# Altium project ASSD_Muestreo.PrjPCB
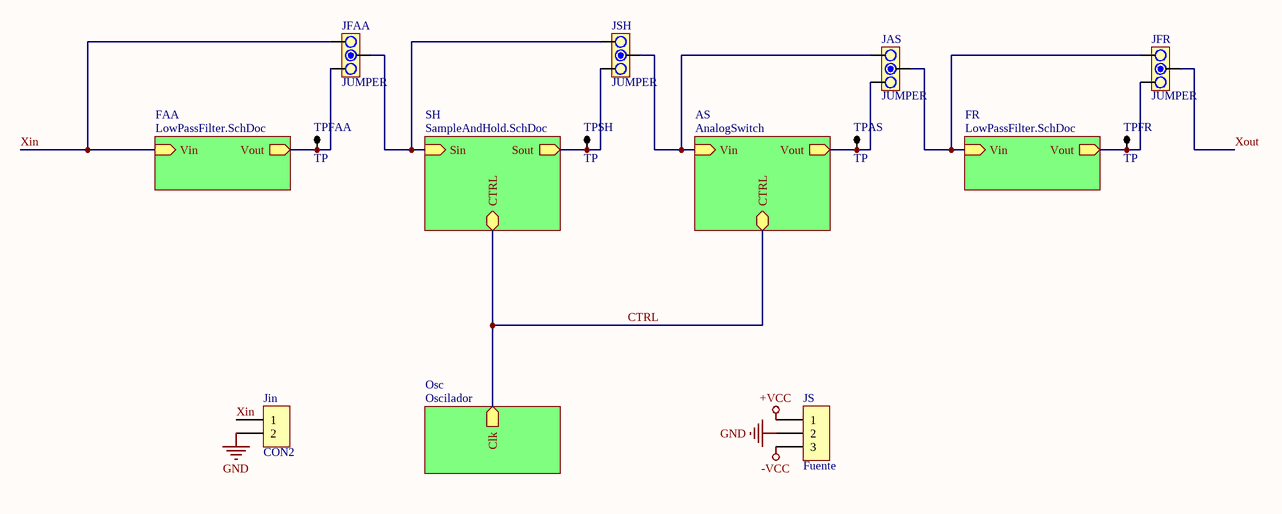
[diagram p0: TP1SCH.SchDoc]
5 sheets, 75 parts. Net scope: hierarchical (ports join the sheet entries above them; power ports are global).
Board file: TP1PCB.PcbDoc
Sheets:
  TP1SCH.SchDoc
    FAA = LowPassFilter.SchDoc
    SH = SampleAndHold.SchDoc
    AS = AnalogSwitch.SchDoc
    FR = LowPassFilter.SchDoc
    Osc = Oscilador.SchDoc

## Sheet TP1SCH.SchDoc
size A4

### Parts
JAS  JUMPER  [JUMPER3]
JFAA  JUMPER  [JUMPER3]
JFR  JUMPER  [JUMPER3]
Jin  CON2  [SIP2]
JS  Fuente  [SIP3]
JSH  JUMPER  [JUMPER3]
TPAS  TP  [TPTH]
TPFAA  TP  [TPTH]
TPFR  TP  [TPTH]
TPSH  TP  [TPTH]

### Sub-sheets
AS = AnalogSwitch: Vin (in), CTRL (bidir), Vout (out)
FAA = LowPassFilter.SchDoc: Vin (in), Vout (out)
FR = LowPassFilter.SchDoc: Vin (in), Vout (out)
Osc = Oscilador: Clk (out)
SH = SampleAndHold.SchDoc: Sin (in), Sout (out), CTRL (bidir)

### Nets
+VCC: JS.1
-VCC: JS.3
GND: Jin.2 JS.2
CTRL: sheet SH/CTRL, sheet AS/CTRL, sheet Osc/Clk
V4out: JFAA.1 TPFAA.1 ; sheet FAA/Vout
V4out: JFR.1 TPFR.1 ; sheet FR/Vout  [a separate net that carries the same name]
Xin: JFAA.3 Jin.1 ; sheet FAA/Vin
Xin: JFAA.2 JSH.3 ; sheet SH/Sin  [a separate net that carries the same name]
Xout: JSH.1 TPSH.1 ; sheet SH/Sout
Xout: JFR.2  [a separate net that carries the same name]
NetJAS_1: JAS.1 TPAS.1 ; sheet AS/Vout
NetJAS_2: JAS.2 JFR.3 ; sheet FR/Vin
NetJAS_3: JAS.3 JSH.2 ; sheet AS/Vin

### Library data of the parts
JAS JFAA JFR JSH = JUMPER3
JS = CON3

## Sheet LowPassFilter.SchDoc
size A4
Used 2 times, as channels FAA, FR. Parts and nets are listed once, with the designators drawn on the sheet.
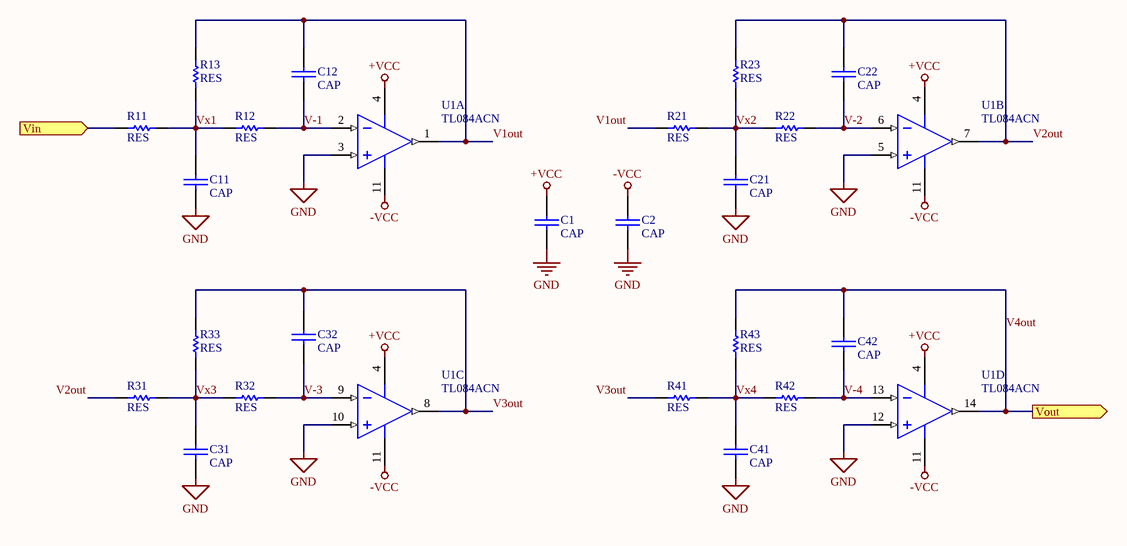
[diagram p1: LowPassFilter.SchDoc]

### Parts
C1  CAP  [CAP200]
C2  CAP  [CAP200]
C11  CAP  [0805]
C12  CAP  [0805]
C21  CAP  [0805]
C22  CAP  [0805]
C31  CAP  [0805]
C32  CAP  [0805]
C41  CAP  [0805]
C42  CAP  [0805]
R11  RES  [0805]
R12  RES  [0805]
R13  RES  [0805]
R21  RES  [0805]
R22  RES  [0805]
R23  RES  [0805]
R31  RES  [0805]
R32  RES  [0805]
R33  RES  [0805]
R41  RES  [0805]
R42  RES  [0805]
R43  RES  [0805]
U1  TL084ACN  [TI-N14]  (parts A,B,C,D of 4)

### Ports
Vin (in), Vout (out)

### Nets
+VCC: C1.1 U1.4(VCC+)
-VCC: C2.1 U1.11(VCC-)
GND: C1.2 C2.2 C11.2 C21.2 C31.2 C41.2 U1.3(IN1+) U1.5(IN2+) U1.10(IN3+) U1.12(IN4+)
V1out: C12.1 R13.1 R21.1 U1.1(OUT1)
V2out: C22.1 R23.1 R31.1 U1.7(OUT2)
V3out: C32.1 R33.1 R41.1 U1.8(OUT3)
V4out: C42.1 R43.1 U1.14(OUT4) ; port Vout
V-1: C12.2 R12.2 U1.2(IN1-)
V-2: C22.2 R22.2 U1.6(IN2-)
V-3: C32.2 R32.2 U1.9(IN3-)
V-4: C42.2 R42.2 U1.13(IN4-)
Vin: R11.1 ; port Vin
Vx1: C11.1 R11.2 R12.1 R13.2
Vx2: C21.1 R21.2 R22.1 R23.2
Vx3: C31.1 R31.2 R32.1 R33.2
Vx4: C41.1 R41.2 R42.1 R43.2

### Channels
FAA: designators end in _FAA; ports Vin=Xin Vout=V4out
FR: designators end in _FR; ports Vin=NetJAS_2 Vout=V4out

### Library data of the parts
U1 = TL084ACN: JFET-Input Operational Amplifier, 7 to 36 V, 0 to 70 degC, 14-pin DIP (N14), Pb-Free (RoHS); Manufacturer: Texas Instruments; CMRR(Min)(dB): 75; GBW(Typ)(MHz): 3; IIB(Max)(pA): 200; Iq per channel(Max)(mA): 2.8; Number of Channels: 4; Offset Drift(Typ)(uV/C): 18; Rating: Catalog; Slew Rate(Typ)(V/us): 13; Sub Family: General Purpose Amplifier, High Supply Voltage Amplifier (>=30V); Total Supply Voltage(Max)(+5V is 5, +/-5V is 10): 36; Total Supply Voltage(Min)(+5V is 5, +/-5V is 10): 7; Vio (25C)(Max)(mV): 6; DatasheetVersion: SLOS081G; PackageVersion: 4040049/E, 12/2002; PackageReference: N14; PackageDescription: 14-Pin Plastic In-Line, Body 19.305 x 6.35 mm, Pitch 2.54 mm; Supplier 1: Digi-Key; Supplier Part Number 1: 296-1782-5-ND; Supplier 2: Farnell; Supplier Part Number 2: 1106129; Supplier 3: Newark; Supplier Part Number 3: 08F9361; Supplier 4: Mouser; Supplier Part Number 4: 595-TL084ACN; Eco-Plan: Pb-Free (RoHS); Vn at 1kHz(Typ)(nV/rtHz): 18; Mounting Technology: Through Hole; Code_JEDEC: MS-001; PartNumber: TL084ACN; ComponentLink1Description: Manufacturer URL; ComponentLink1URL: http://www.ti.com/; ComponentLink2Description: Datasheet; ComponentLink2URL: http://www.ti.com/lit/ds/symlink/tl084a.pdf; ComponentLink3Description: Package Specification; ComponentLink3URL: http://www.ti.com/lit/ml/mpdi002c/mpdi002c.pdf

## Sheet SampleAndHold.SchDoc
size A4
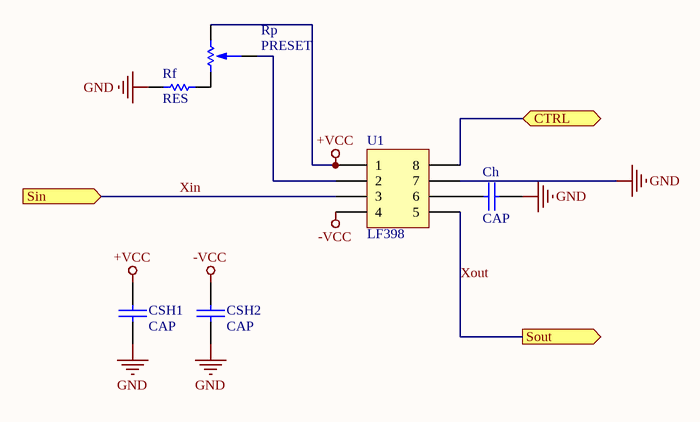
[diagram p2: SampleAndHold.SchDoc]

### Parts
Ch  CAP  [CAP200]
CSH1  CAP  [CAP200]
CSH2  CAP  [CAP200]
Rf  RES  [RES400]
Rp  PRESET  [PRESET V]
U1  LF398  [DIP8]

### Ports
CTRL (bidir), Sin (in), Sout (out)

### Nets
+VCC: CSH1.1 Rp.1 U1.1
-VCC: CSH2.1 U1.4
GND: Ch.2 CSH1.2 CSH2.2 Rf.1 U1.7
CTRL: U1.8 ; port CTRL
Xin: U1.3 ; port Sin
Xout: U1.5 ; port Sout
NetCh_1: Ch.1 U1.6
NetRf_2: Rf.2 Rp.3
NetRp_2: Rp.2 U1.2

### Library data of the parts
U1 = IC_DIP8

## Sheet AnalogSwitch.SchDoc
size A4
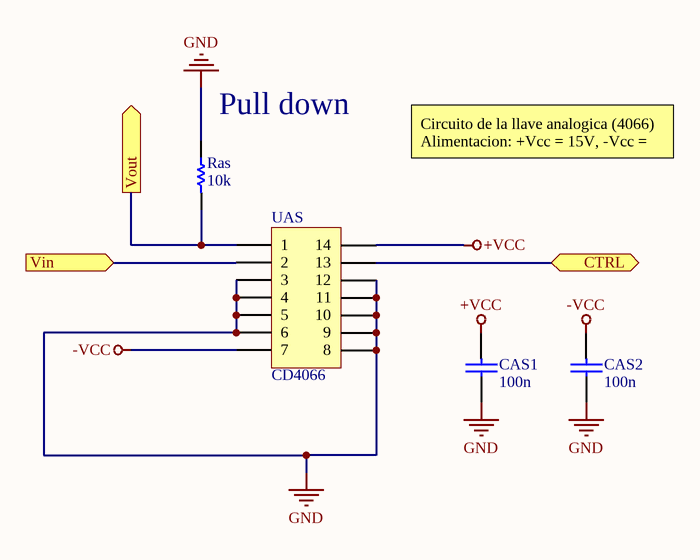
[diagram p3: AnalogSwitch.SchDoc]

### Parts
CAS1  100n  [CAP200]
CAS2  100n  [CAP200]
Ras  10k  [RES400]
UAS  CD4066  [DIP14]

### Ports
CTRL (bidir), Vin (in), Vout (out)

### Nets
+VCC: CAS1.1 UAS.14
-VCC: CAS2.1 UAS.7
GND: CAS1.2 CAS2.2 Ras.1 UAS.3 UAS.4 UAS.5 UAS.6 UAS.8 UAS.9 UAS.10 UAS.11 UAS.12
CTRL: UAS.13 ; port CTRL
NetJAS_1: Ras.2 UAS.1 ; port Vout
NetJAS_3: UAS.2 ; port Vin

### Notes on the sheet
- (near Ras) Pull down
- Circuito de la llave analogica (4066)
  Alimentacion: +Vcc = 15V, -Vcc = -15V

### Library data of the parts
CAS1 CAS2 = CAP
Ras = RES
UAS = IC_DIP14

## Sheet Oscilador.SchDoc
size A4
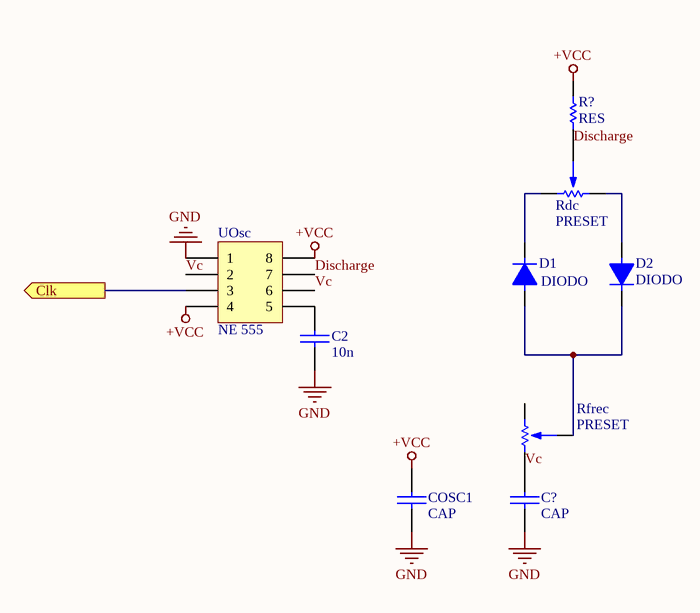
[diagram p4: Oscilador.SchDoc]

### Parts
C2  10n  [CAP200]
C?  CAP  [CAP200]
COSC1  CAP  [CAP200]
D1  DIODO  [DO41]
D2  DIODO  [DO41]
R?  RES  [RES400]
Rdc  PRESET  [PRESET V]
Rfrec  PRESET  [PRESET V]
UOsc  NE 555  [DIP8]

### Ports
Clk (out)

### Nets
+VCC: COSC1.1 R?.1 UOsc.4 UOsc.8
GND: C2.2 C?.2 COSC1.2 UOsc.1
CTRL: UOsc.3 ; port Clk
Discharge: R?.2 Rdc.2 UOsc.7
Vc: C?.1 Rfrec.3 UOsc.2 UOsc.6
NetC2_1: C2.1 UOsc.5
NetD1_1: D1.1 D2.2 Rfrec.2
NetD1_2: D1.2 Rdc.1
NetD2_1: D2.1 Rdc.3

Not connected (* = marked no-connect by the designer): Rfrec 1

### Library data of the parts
C2 = CAP
UOsc = IC_DIP8

## Nets that join several sheets
+VCC: TP1SCH (JS.1), FAA (C1_FAA.1 U1_FAA.4), SampleAndHold (CSH1.1 Rp.1 U1.1), AnalogSwitch (CAS1.1 UAS.14), FR (C1_FR.1 U1_FR.4), Oscilador (COSC1.1 R?.1 UOsc.4 UOsc.8)
-VCC: TP1SCH (JS.3), FAA (C2_FAA.1 U1_FAA.11), SampleAndHold (CSH2.1 U1.4), AnalogSwitch (CAS2.1 UAS.7), FR (C2_FR.1 U1_FR.11)
GND: TP1SCH (Jin.2 JS.2), FAA (10 pins), SampleAndHold (5 pins), AnalogSwitch (12 pins), FR (10 pins), Oscilador (C2.2 C?.2 COSC1.2 UOsc.1)
CTRL: SampleAndHold (U1.8), AnalogSwitch (UAS.13), Oscilador (UOsc.3)
NetJAS_1: TP1SCH (JAS.1 TPAS.1), AnalogSwitch (Ras.2 UAS.1)
NetJAS_2: TP1SCH (JAS.2 JFR.3), FR (R11_FR.1)
NetJAS_3: TP1SCH (JAS.3 JSH.2), AnalogSwitch (UAS.2)
V4out: TP1SCH (JFAA.1 TPFAA.1), FAA (C42_FAA.1 R43_FAA.1 U1_FAA.14)
V4out: TP1SCH (JFR.1 TPFR.1), FR (C42_FR.1 R43_FR.1 U1_FR.14)
Xin: TP1SCH (JFAA.3 Jin.1), FAA (R11_FAA.1)
Xin: TP1SCH (JFAA.2 JSH.3), SampleAndHold (U1.3)
Xout: TP1SCH (JSH.1 TPSH.1), SampleAndHold (U1.5)